# Altium schematic sheet 1.GPIO.SchDoc
size A3; SheetNumber: 2; SheetTotal: 10
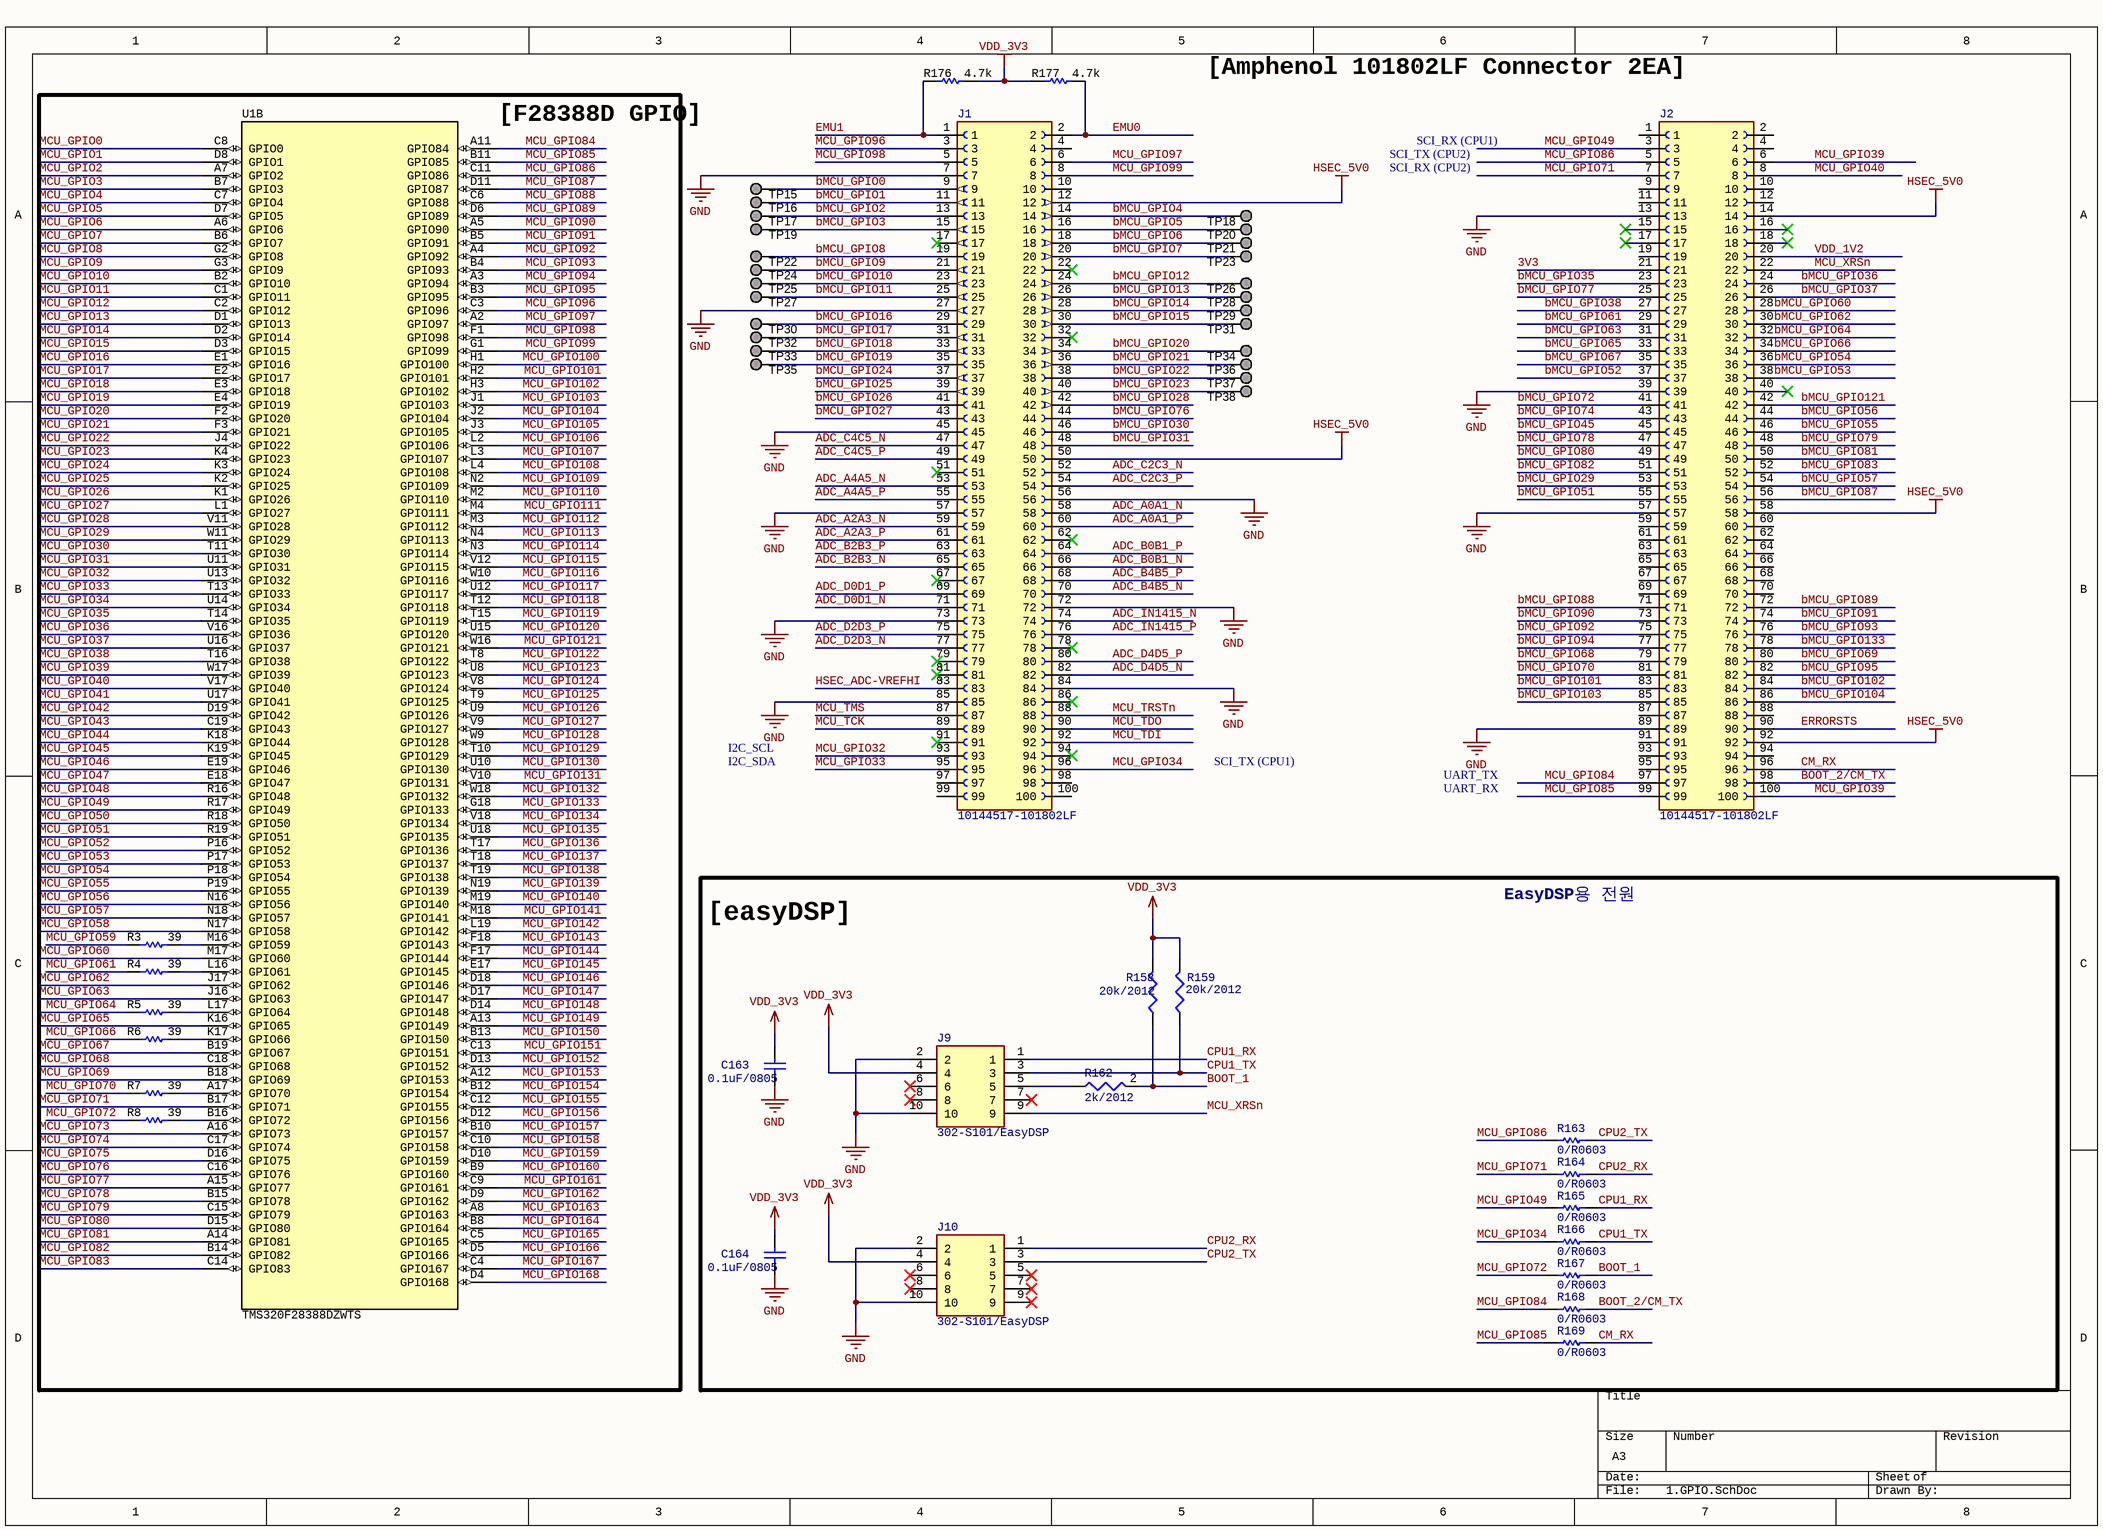
[diagram p0: 1.GPIO.SchDoc]

## Parts
C163  value 0.1uF/0805  [CAPC2013X135X45NL10T25]  (hidden comment: C2012)
C164  value 0.1uF/0805  [CAPC2013X135X45NL10T25]  (hidden comment: C2012)
J1  10144517-101802LF  [AMPHENOL_10144517-101802LF]
J2  10144517-101802LF  [AMPHENOL_10144517-101802LF]
J9  302-S101/EasyDSP  [SHDR10W66P254_2X5_2030X905X905P]
J10  302-S101/EasyDSP  [SHDR10W66P254_2X5_2030X905X905P]
R3  ValueDisplayed: 39  [0402]  (hidden comment: CRCW040239R0JNED)
R4  ValueDisplayed: 39  [0402]  (hidden comment: CRCW040239R0JNED)
R5  ValueDisplayed: 39  [0402]  (hidden comment: CRCW040239R0JNED)
R6  ValueDisplayed: 39  [0402]  (hidden comment: CRCW040239R0JNED)
R7  ValueDisplayed: 39  [0402]  (hidden comment: CRCW040239R0JNED)
R8  ValueDisplayed: 39  [0402]  (hidden comment: CRCW040239R0JNED)
R158  value 20k/2012  [RESC0805(2012)_L]  (hidden comment: R2012)
R159  value 20k/2012  [RESC0805(2012)_L]  (hidden comment: R2012)
R162  value 2k/2012  [RESC0805(2012)_L]  (hidden comment: R2012)
R163  value 0/R0603  [RESC1608X55X25ML10T15]  (hidden comment: Resistor 0R +/- 5% 0603 100 mW)
R164  value 0/R0603  [RESC1608X55X25ML10T15]  (hidden comment: Resistor 0R +/- 5% 0603 100 mW)
R165  value 0/R0603  [RESC1608X55X25ML10T15]  (hidden comment: Resistor 0R +/- 5% 0603 100 mW)
R166  value 0/R0603  [RESC1608X55X25ML10T15]  (hidden comment: Resistor 0R +/- 5% 0603 100 mW)
R167  value 0/R0603  [RESC1608X55X25ML10T15]  (hidden comment: Resistor 0R +/- 5% 0603 100 mW)
R168  value 0/R0603  [RESC1608X55X25ML10T15]  (hidden comment: Resistor 0R +/- 5% 0603 100 mW)
R169  value 0/R0603  [RESC1608X55X25ML10T15]  (hidden comment: Resistor 0R +/- 5% 0603 100 mW)
R176  ValueDisplayed: 4.7k  [0402]  (hidden comment: CRCW04024K70JNED)
R177  ValueDisplayed: 4.7k  [0402]  (hidden comment: CRCW04024K70JNED)
TP15  TESTPOINT  [TP_50MIL-25MILHOLE]  (value not drawn)  (no BOM)
TP16  TESTPOINT  [TP_50MIL-25MILHOLE]  (value not drawn)  (no BOM)
TP17  TESTPOINT  [TP_50MIL-25MILHOLE]  (value not drawn)  (no BOM)
TP18  TESTPOINT  [TP_50MIL-25MILHOLE]  (value not drawn)  (no BOM)
TP19  TESTPOINT  [TP_50MIL-25MILHOLE]  (value not drawn)  (no BOM)
TP20  TESTPOINT  [TP_50MIL-25MILHOLE]  (value not drawn)  (no BOM)
TP21  TESTPOINT  [TP_50MIL-25MILHOLE]  (value not drawn)  (no BOM)
TP22  TESTPOINT  [TP_50MIL-25MILHOLE]  (value not drawn)  (no BOM)
TP23  TESTPOINT  [TP_50MIL-25MILHOLE]  (value not drawn)  (no BOM)
TP24  TESTPOINT  [TP_50MIL-25MILHOLE]  (value not drawn)  (no BOM)
TP25  TESTPOINT  [TP_50MIL-25MILHOLE]  (value not drawn)  (no BOM)
TP26  TESTPOINT  [TP_50MIL-25MILHOLE]  (value not drawn)  (no BOM)
TP27  TESTPOINT  [TP_50MIL-25MILHOLE]  (value not drawn)  (no BOM)
TP28  TESTPOINT  [TP_50MIL-25MILHOLE]  (value not drawn)  (no BOM)
TP29  TESTPOINT  [TP_50MIL-25MILHOLE]  (value not drawn)  (no BOM)
TP30  TESTPOINT  [TP_50MIL-25MILHOLE]  (value not drawn)  (no BOM)
TP31  TESTPOINT  [TP_50MIL-25MILHOLE]  (value not drawn)  (no BOM)
TP32  TESTPOINT  [TP_50MIL-25MILHOLE]  (value not drawn)  (no BOM)
TP33  TESTPOINT  [TP_50MIL-25MILHOLE]  (value not drawn)  (no BOM)
TP34  TESTPOINT  [TP_50MIL-25MILHOLE]  (value not drawn)  (no BOM)
TP35  TESTPOINT  [TP_50MIL-25MILHOLE]  (value not drawn)  (no BOM)
TP36  TESTPOINT  [TP_50MIL-25MILHOLE]  (value not drawn)  (no BOM)
TP37  TESTPOINT  [TP_50MIL-25MILHOLE]  (value not drawn)  (no BOM)
TP38  TESTPOINT  [TP_50MIL-25MILHOLE]  (value not drawn)  (no BOM)
U1  TMS320F28388DZWTS  [ZWT0337A-IPC_B]  (part B of 5)

## Blocks framed on the sheet
[F28388D GPIO]: R3-R8 U1
[easyDSP]: C163 C164 J9 J10 R158 R159 R162-R169

## Nets
GND: C163.2 C164.2 J1.7 J1.27 J1.45 J1.56 J1.57 J1.72 J1.73 J1.84 J1.85 J2.13 J2.39 J2.57 J2.89 J9.2 J9.10 J10.2 J10.10
HSEC_5V0: J1.12 J1.50 J2.14 J2.58 J2.92
VDD_3V3: C163.1 C164.1 J9.4 J10.4 R158.2 R159.2 R176.2 R177.1
3V3: J2.21
ADC_A0A1_N: J1.58
ADC_A0A1_P: J1.60
ADC_A2A3_N: J1.59
ADC_A2A3_P: J1.61
ADC_A4A5_N: J1.53
ADC_A4A5_P: J1.55
ADC_B0B1_N: J1.66
ADC_B0B1_P: J1.64
ADC_B2B3_N: J1.65
ADC_B2B3_P: J1.63
ADC_B4B5_N: J1.70
ADC_B4B5_P: J1.68
ADC_C2C3_N: J1.52
ADC_C2C3_P: J1.54
ADC_C4C5_N: J1.47
ADC_C4C5_P: J1.49
ADC_D0D1_N: J1.71
ADC_D0D1_P: J1.69
ADC_D2D3_N: J1.77
ADC_D2D3_P: J1.75
ADC_D4D5_N: J1.82
ADC_D4D5_P: J1.80
ADC_IN1415_N: J1.74
ADC_IN1415_P: J1.76
bMCU_GPIO0: J1.9 TP15.1
bMCU_GPIO1: J1.11 TP16.1
bMCU_GPIO2: J1.13 TP17.1
bMCU_GPIO3: J1.15 TP19.1
bMCU_GPIO4: J1.14 TP18.1
bMCU_GPIO5: J1.16 TP20.1
bMCU_GPIO6: J1.18 TP21.1
bMCU_GPIO7: J1.20 TP23.1
bMCU_GPIO8: J1.19 TP22.1
bMCU_GPIO9: J1.21 TP24.1
bMCU_GPIO10: J1.23 TP25.1
bMCU_GPIO11: J1.25 TP27.1
bMCU_GPIO12: J1.24 TP26.1
bMCU_GPIO13: J1.26 TP28.1
bMCU_GPIO14: J1.28 TP29.1
bMCU_GPIO15: J1.30 TP31.1
bMCU_GPIO16: J1.29 TP30.1
bMCU_GPIO17: J1.31 TP32.1
bMCU_GPIO18: J1.33 TP33.1
bMCU_GPIO19: J1.35 TP35.1
bMCU_GPIO20: J1.34 TP34.1
bMCU_GPIO21: J1.36 TP36.1
bMCU_GPIO22: J1.38 TP37.1
bMCU_GPIO23: J1.40 TP38.1
bMCU_GPIO24: J1.37
bMCU_GPIO25: J1.39
bMCU_GPIO26: J1.41
bMCU_GPIO27: J1.43
bMCU_GPIO28: J1.42
bMCU_GPIO29: J2.53
bMCU_GPIO30: J1.46
bMCU_GPIO31: J1.48
bMCU_GPIO35: J2.23
bMCU_GPIO36: J2.24
bMCU_GPIO37: J2.26
bMCU_GPIO38: J2.27
bMCU_GPIO45: J2.45
bMCU_GPIO51: J2.55
bMCU_GPIO52: J2.37
bMCU_GPIO53: J2.38
bMCU_GPIO54: J2.36
bMCU_GPIO55: J2.46
bMCU_GPIO56: J2.44
bMCU_GPIO57: J2.54
bMCU_GPIO60: J2.28
bMCU_GPIO61: J2.29
bMCU_GPIO62: J2.30
bMCU_GPIO63: J2.31
bMCU_GPIO64: J2.32
bMCU_GPIO65: J2.33
bMCU_GPIO66: J2.34
bMCU_GPIO67: J2.35
bMCU_GPIO68: J2.79
bMCU_GPIO69: J2.80
bMCU_GPIO70: J2.81
bMCU_GPIO72: J2.41
bMCU_GPIO74: J2.43
bMCU_GPIO76: J1.44
bMCU_GPIO77: J2.25
bMCU_GPIO78: J2.47
bMCU_GPIO79: J2.48
bMCU_GPIO80: J2.49
bMCU_GPIO81: J2.50
bMCU_GPIO82: J2.51
bMCU_GPIO83: J2.52
bMCU_GPIO87: J2.56
bMCU_GPIO88: J2.71
bMCU_GPIO89: J2.72
bMCU_GPIO90: J2.73
bMCU_GPIO91: J2.74
bMCU_GPIO92: J2.75
bMCU_GPIO93: J2.76
bMCU_GPIO94: J2.77
bMCU_GPIO95: J2.82
bMCU_GPIO101: J2.83
bMCU_GPIO102: J2.84
bMCU_GPIO103: J2.85
bMCU_GPIO104: J2.86
bMCU_GPIO121: J2.42
bMCU_GPIO133: J2.78
BOOT_1: R158.1 R162.2 R167.2
BOOT_2/CM_TX: J2.98 R168.2
CM_RX: J2.96 R169.2
CPU1_RX: J9.1 R165.2
CPU1_TX: J9.3 R159.1 R166.2
CPU2_RX: J10.1 R164.2
CPU2_TX: J10.3 R163.2
EMU0: J1.2 R177.2
EMU1: J1.1 R176.1
ERRORSTS: J2.90
HSEC_ADC-VREFHI: J1.83
MCU_GPIO0: U1.C8(GPIO0)
MCU_GPIO1: U1.D8(GPIO1)
MCU_GPIO2: U1.A7(GPIO2)
MCU_GPIO3: U1.B7(GPIO3)
MCU_GPIO4: U1.C7(GPIO4)
MCU_GPIO5: U1.D7(GPIO5)
MCU_GPIO6: U1.A6(GPIO6)
MCU_GPIO7: U1.B6(GPIO7)
MCU_GPIO8: U1.G2(GPIO8)
MCU_GPIO9: U1.G3(GPIO9)
MCU_GPIO10: U1.B2(GPIO10)
MCU_GPIO11: U1.C1(GPIO11)
MCU_GPIO12: U1.C2(GPIO12)
MCU_GPIO13: U1.D1(GPIO13)
MCU_GPIO14: U1.D2(GPIO14)
MCU_GPIO15: U1.D3(GPIO15)
MCU_GPIO16: U1.E1(GPIO16)
MCU_GPIO17: U1.E2(GPIO17)
MCU_GPIO18: U1.E3(GPIO18)
MCU_GPIO19: U1.E4(GPIO19)
MCU_GPIO20: U1.F2(GPIO20)
MCU_GPIO21: U1.F3(GPIO21)
MCU_GPIO22: U1.J4(GPIO22)
MCU_GPIO23: U1.K4(GPIO23)
MCU_GPIO24: U1.K3(GPIO24)
MCU_GPIO25: U1.K2(GPIO25)
MCU_GPIO26: U1.K1(GPIO26)
MCU_GPIO27: U1.L1(GPIO27)
MCU_GPIO28: U1.V11(GPIO28)
MCU_GPIO29: U1.W11(GPIO29)
MCU_GPIO30: U1.T11(GPIO30)
MCU_GPIO31: U1.U11(GPIO31)
MCU_GPIO32: J1.93 U1.U13(GPIO32)
MCU_GPIO33: J1.95 U1.T13(GPIO33)
MCU_GPIO34: J1.96 R166.1 U1.U14(GPIO34)
MCU_GPIO35: U1.T14(GPIO35)
MCU_GPIO36: U1.V16(GPIO36)
MCU_GPIO37: U1.U16(GPIO37)
MCU_GPIO38: U1.T16(GPIO38)
MCU_GPIO39: J2.6 J2.100 U1.W17(GPIO39)
MCU_GPIO40: J2.8 U1.V17(GPIO40)
MCU_GPIO41: U1.U17(GPIO41)
MCU_GPIO42: U1.D19(GPIO42)
MCU_GPIO43: U1.C19(GPIO43)
MCU_GPIO44: U1.K18(GPIO44)
MCU_GPIO45: U1.K19(GPIO45)
MCU_GPIO46: U1.E19(GPIO46)
MCU_GPIO47: U1.E18(GPIO47)
MCU_GPIO48: U1.R16(GPIO48)
MCU_GPIO49: J2.3 R165.1 U1.R17(GPIO49)
MCU_GPIO50: U1.R18(GPIO50)
MCU_GPIO51: U1.R19(GPIO51)
MCU_GPIO52: U1.P16(GPIO52)
MCU_GPIO53: U1.P17(GPIO53)
MCU_GPIO54: U1.P18(GPIO54)
MCU_GPIO55: U1.P19(GPIO55)
MCU_GPIO56: U1.N16(GPIO56)
MCU_GPIO57: U1.N18(GPIO57)
MCU_GPIO58: U1.N17(GPIO58)
MCU_GPIO59: R3.1
MCU_GPIO60: U1.M17(GPIO60)
MCU_GPIO61: R4.1
MCU_GPIO62: U1.J17(GPIO62)
MCU_GPIO63: U1.J16(GPIO63)
MCU_GPIO64: R5.1
MCU_GPIO65: U1.K16(GPIO65)
MCU_GPIO66: R6.1
MCU_GPIO67: U1.B19(GPIO67)
MCU_GPIO68: U1.C18(GPIO68)
MCU_GPIO69: U1.B18(GPIO69)
MCU_GPIO70: R7.1
MCU_GPIO71: J2.7 R164.1 U1.B17(GPIO71)
MCU_GPIO72: R8.1 R167.1
MCU_GPIO73: U1.A16(GPIO73)
MCU_GPIO74: U1.C17(GPIO74)
MCU_GPIO75: U1.D16(GPIO75)
MCU_GPIO76: U1.C16(GPIO76)
MCU_GPIO77: U1.A15(GPIO77)
MCU_GPIO78: U1.B15(GPIO78)
MCU_GPIO79: U1.C15(GPIO79)
MCU_GPIO80: U1.D15(GPIO80)
MCU_GPIO81: U1.A14(GPIO81)
MCU_GPIO82: U1.B14(GPIO82)
MCU_GPIO83: U1.C14(GPIO83)
MCU_GPIO84: J2.97 R168.1 U1.A11(GPIO84)
MCU_GPIO85: J2.99 R169.1 U1.B11(GPIO85)
MCU_GPIO86: J2.5 R163.1 U1.C11(GPIO86)
MCU_GPIO87: U1.D11(GPIO87)
MCU_GPIO88: U1.C6(GPIO88)
MCU_GPIO89: U1.D6(GPIO89)
MCU_GPIO90: U1.A5(GPIO90)
MCU_GPIO91: U1.B5(GPIO91)
MCU_GPIO92: U1.A4(GPIO92)
MCU_GPIO93: U1.B4(GPIO93)
MCU_GPIO94: U1.A3(GPIO94)
MCU_GPIO95: U1.B3(GPIO95)
MCU_GPIO96: J1.3 U1.C3(GPIO96)
MCU_GPIO97: J1.6 U1.A2(GPIO97)
MCU_GPIO98: J1.5 U1.F1(GPIO98)
MCU_GPIO99: J1.8 U1.G1(GPIO99)
MCU_GPIO100: U1.H1(GPIO100)
MCU_GPIO101: U1.H2(GPIO101)
MCU_GPIO102: U1.H3(GPIO102)
MCU_GPIO103: U1.J1(GPIO103)
MCU_GPIO104: U1.J2(GPIO104)
MCU_GPIO105: U1.J3(GPIO105)
MCU_GPIO106: U1.L2(GPIO106)
MCU_GPIO107: U1.L3(GPIO107)
MCU_GPIO108: U1.L4(GPIO108)
MCU_GPIO109: U1.N2(GPIO109)
MCU_GPIO110: U1.M2(GPIO110)
MCU_GPIO111: U1.M4(GPIO111)
MCU_GPIO112: U1.M3(GPIO112)
MCU_GPIO113: U1.N4(GPIO113)
MCU_GPIO114: U1.N3(GPIO114)
MCU_GPIO115: U1.V12(GPIO115)
MCU_GPIO116: U1.W10(GPIO116)
MCU_GPIO117: U1.U12(GPIO117)
MCU_GPIO118: U1.T12(GPIO118)
MCU_GPIO119: U1.T15(GPIO119)
MCU_GPIO120: U1.U15(GPIO120)
MCU_GPIO121: U1.W16(GPIO121)
MCU_GPIO122: U1.T8(GPIO122)
MCU_GPIO123: U1.U8(GPIO123)
MCU_GPIO124: U1.V8(GPIO124)
MCU_GPIO125: U1.T9(GPIO125)
MCU_GPIO126: U1.U9(GPIO126)
MCU_GPIO127: U1.V9(GPIO127)
MCU_GPIO128: U1.W9(GPIO128)
MCU_GPIO129: U1.T10(GPIO129)
MCU_GPIO130: U1.U10(GPIO130)
MCU_GPIO131: U1.V10(GPIO131)
MCU_GPIO132: U1.W18(GPIO132)
MCU_GPIO133: U1.G18(GPIO133)
MCU_GPIO134: U1.V18(GPIO134)
MCU_GPIO135: U1.U18(GPIO135)
MCU_GPIO136: U1.T17(GPIO136)
MCU_GPIO137: U1.T18(GPIO137)
MCU_GPIO138: U1.T19(GPIO138)
MCU_GPIO139: U1.N19(GPIO139)
MCU_GPIO140: U1.M19(GPIO140)
MCU_GPIO141: U1.M18(GPIO141)
MCU_GPIO142: U1.L19(GPIO142)
MCU_GPIO143: U1.F18(GPIO143)
MCU_GPIO144: U1.F17(GPIO144)
MCU_GPIO145: U1.E17(GPIO145)
MCU_GPIO146: U1.D18(GPIO146)
MCU_GPIO147: U1.D17(GPIO147)
MCU_GPIO148: U1.D14(GPIO148)
MCU_GPIO149: U1.A13(GPIO149)
MCU_GPIO150: U1.B13(GPIO150)
MCU_GPIO151: U1.C13(GPIO151)
MCU_GPIO152: U1.D13(GPIO152)
MCU_GPIO153: U1.A12(GPIO153)
MCU_GPIO154: U1.B12(GPIO154)
MCU_GPIO155: U1.C12(GPIO155)
MCU_GPIO156: U1.D12(GPIO156)
MCU_GPIO157: U1.B10(GPIO157)
MCU_GPIO158: U1.C10(GPIO158)
MCU_GPIO159: U1.D10(GPIO159)
MCU_GPIO160: U1.B9(GPIO160)
MCU_GPIO161: U1.C9(GPIO161)
MCU_GPIO162: U1.D9(GPIO162)
MCU_GPIO163: U1.A8(GPIO163)
MCU_GPIO164: U1.B8(GPIO164)
MCU_GPIO165: U1.C5(GPIO165)
MCU_GPIO166: U1.D5(GPIO166)
MCU_GPIO167: U1.C4(GPIO167)
MCU_GPIO168: U1.D4(GPIO168)
MCU_TCK: J1.89
MCU_TDI: J1.92
MCU_TDO: J1.90
MCU_TMS: J1.87
MCU_TRSTn: J1.88
MCU_XRSn: J2.22 J9.9
VDD_1V2: J2.20
NetJ9_5: J9.5 R162.1
NetR3_2: R3.2 U1.M16(GPIO59)
NetR4_2: R4.2 U1.L16(GPIO61)
NetR5_2: R5.2 U1.L17(GPIO64)
NetR6_2: R6.2 U1.K17(GPIO66)
NetR7_2: R7.2 U1.A17(GPIO70)
NetR8_2: R8.2 U1.B16(GPIO72)

Not connected (* = marked no-connect by the designer): J1 4 10 17* 22* 32* 51* 62* 67* 78* 79* 81* 86* 91* 94* 97 98 99 100; J2 1 2 4 9 10 11 12 15* 16* 17* 18* 19 40* 59 60 61 62 63 64 65 66 67 68 69 70 87 88 91 93 94 95; J9 6* 7* 8*; J10 5* 6* 7* 8* 9*

## Notes on the sheet
- [Amphenol 101802LF Connector 2EA]
- SCI_TX (CPU2)
- SCI_RX (CPU2)
- SCI_RX (CPU1)
- I2C_SCL
- I2C_SDA
- SCI_TX (CPU1)
- UART_RX
- UART_TX
- EasyDSP용 전원

## Library data of the parts
C163 C164 = CMP-001-00007-7: Chip Capacitor, 1 uF, +/- 10%, 50 V, 0805 (2012 Metric); Voltage Rating: 50V; Capacitor Type: Ceramic; Case/Package: 0805; Min Operating Temperature: -55°C; Max Operating Temperature: 125°C; Pins: 2; Tolerance: 10%; RoHS Compliant: True; Mounting Technology: SM
J1 J2 = CMP-002-00178-1: Socket(male) 100 Positions, Dual Row, Vertical Receptacle. BergStak Lite 0.80mm, Board-to-Board Connector,; MF: AMPHENOL ICC / FCI; Source: SamacSys.SchLib; Check_prices: https://www.snapeda.com/parts/10144517-101802LF/Amphenol/view-part/?ref=eda; Value: *; Case/Package: None; MP: 10144517-101802LF; Design Item ID: 10144517-101802LF; SnapEDA_Link: https://www.snapeda.com/parts/10144517-101802LF/Amphenol/view-part/?ref=snap
J9 J10 = CMP-002-00158-1: 10 Positions Header Connector 0.100" (2.54mm) Through Hole Gold; Manufacturer_Name: On Shore Technology Inc.; Design Item ID: 302-S101; Manufacturer_Part_Number: 302-S101; Arrow Part Number: 302-S101; Datasheet Link: https://www.digikey.com/product-detail/en/on-shore-technology-inc/302-S101/ED1543-ND/2178422; Source: SamacSys.SchLib; Arrow Price/Stock: https://www.arrow.com/en/products/302-s101/on-shore-technology?utm_currency=USD&region=nac; Height: 9.05mm
R3-R8 = CMP-0026916-3: RES, 39, 5%, 0.063 W, AEC-Q200 Grade 0, 0402; Manufacturer: Vishay-Dale; Power_W: 63mW; TempCo: 200 ppm/C; Value_Code: 39R0; Value: 39; EIA_Code: E24; SizeX_mm: 1; SizeY_mm: 0.5; SizeZ_mm: 0.6; Value2: 0.063W; AEC Qualified: Y; VDC_V: 50V; AEC Category: Q200; AEC Grade: 0; Supplier Part Number 2: 89M6649; Supplier 2: Newark; Supplier Part Number 3: 71-CRCW0402J-39-E3; Supplier 3: Mouser; RoHS: E; Value1: 5%; MountType: SMT; Supplier 1: Digi-Key; PackageReference: 0402; Tolerance_%: 5%; Res_ohm: 39; SizeArea_mm2: 0.5; CompType: Resistor; PartNumber: CRCW040239R0JNED; ComponentLink1Description: Datasheet link; Supplier Part Number 1: 541-39JCT-ND; Technology: Thick Film; ComponentLink1URL: http://www.vishay.com/docs/20035/dcrcwe3.pdf
R158 R159 R162 = CMP-009-00174-4: Chip Resistor, 4,7 Ohms, +/-5 %, 125 mW, -55 to 155 degC, 0805; Power: 125mW; Tolerance: 5%; Max Operating Temperature: 155°C; Pins: 2; Case/Package: 0805; Min Operating Temperature: -55°C
R163-R169 = CMP-009-00006-5: Chip Resistor, 0 Ohm, 0.1 W, -55 to 155 degC, 0603 (1608 Metric); Power: 100mW; Voltage Rating: 50V; Max Operating Temperature: 155°C; RoHS Compliant: True; Mounting Technology: SM; Case/Package: 0603; Min Operating Temperature: -55°C; Tolerance: 5%; Pins: 2
R176 R177 = CMP-0026938-5: RES, 4.7 k, 5%, 0.063 W, AEC-Q200 Grade 0, 0402; Manufacturer: Vishay-Dale; Power_W: 63mW; TempCo: 200 ppm/C; Value_Code: 4k70; Value: 4.7k; EIA_Code: E24; SizeX_mm: 1; SizeY_mm: 0.5; SizeZ_mm: 0.6; Value2: 0.063W; AEC Qualified: Y; VDC_V: 50V; AEC Category: Q200; AEC Grade: 0; Supplier Part Number 2: 59M6733; Supplier 2: Newark; Supplier Part Number 3: 71-CRCW0402J-4.7K-E3; Supplier 3: Mouser; RoHS: E; Value1: 5%; MountType: SMT; Supplier 1: Digi-Key; PackageReference: 0402; Tolerance_%: 5%; Res_ohm: 4.7k; SizeArea_mm2: 0.5; CompType: Resistor; PartNumber: CRCW04024K70JNED; ComponentLink1Description: Datasheet link; Supplier Part Number 1: 541-4.7KJCT-ND; Technology: Thick Film; ComponentLink1URL: http://www.vishay.com/docs/20035/dcrcwe3.pdf
TP15-TP38 = CMP-0078143-3: TEST POINT.  No entry in BOM.; CompType: Testpoint; PackageReference: N/A; Manufacturer: N/A; PartNumber: N/A; Library Reference: TESTPOINT
U1 = CMP-012-000147-1: TMS320F28388DZWTS, ZWT0337A (NFBGA-337); Manufacturer: Texas Instruments; SizeAreaWB_mm2: 324; SizeArea_mm2: 256; AEC Qualified: N; AEC Category: Q200; SizeZ_mm: 1.4; SizeY_mm: 16; CompType: IC; Available Preview Images: 2D; ComponentLink1Description: Datasheet Link; ComponentLink2Description: Product Folder; PackageReference: ZWT0337A; PartNumber: TMS320F28388DZWTS; PackageDescription: NFBGA-337; ComponentLink2URL: http://www.ti.com/product/tms320f28388d; Alternate Manufacturer: Texas Instruments; ComponentLink3URL: http://www.ti.com/product/tms320f28388d/datasheet; ComponentLink1URL: http://www.ti.com/lit/ds/symlink/tms320f28388d.pdf; MountType: SMT; ComponentLink3Description: Online Datasheet; SizeX_mm: 16; Design Item ID: TMS320F28388DZWTS; Source: SamacSys.SchLib